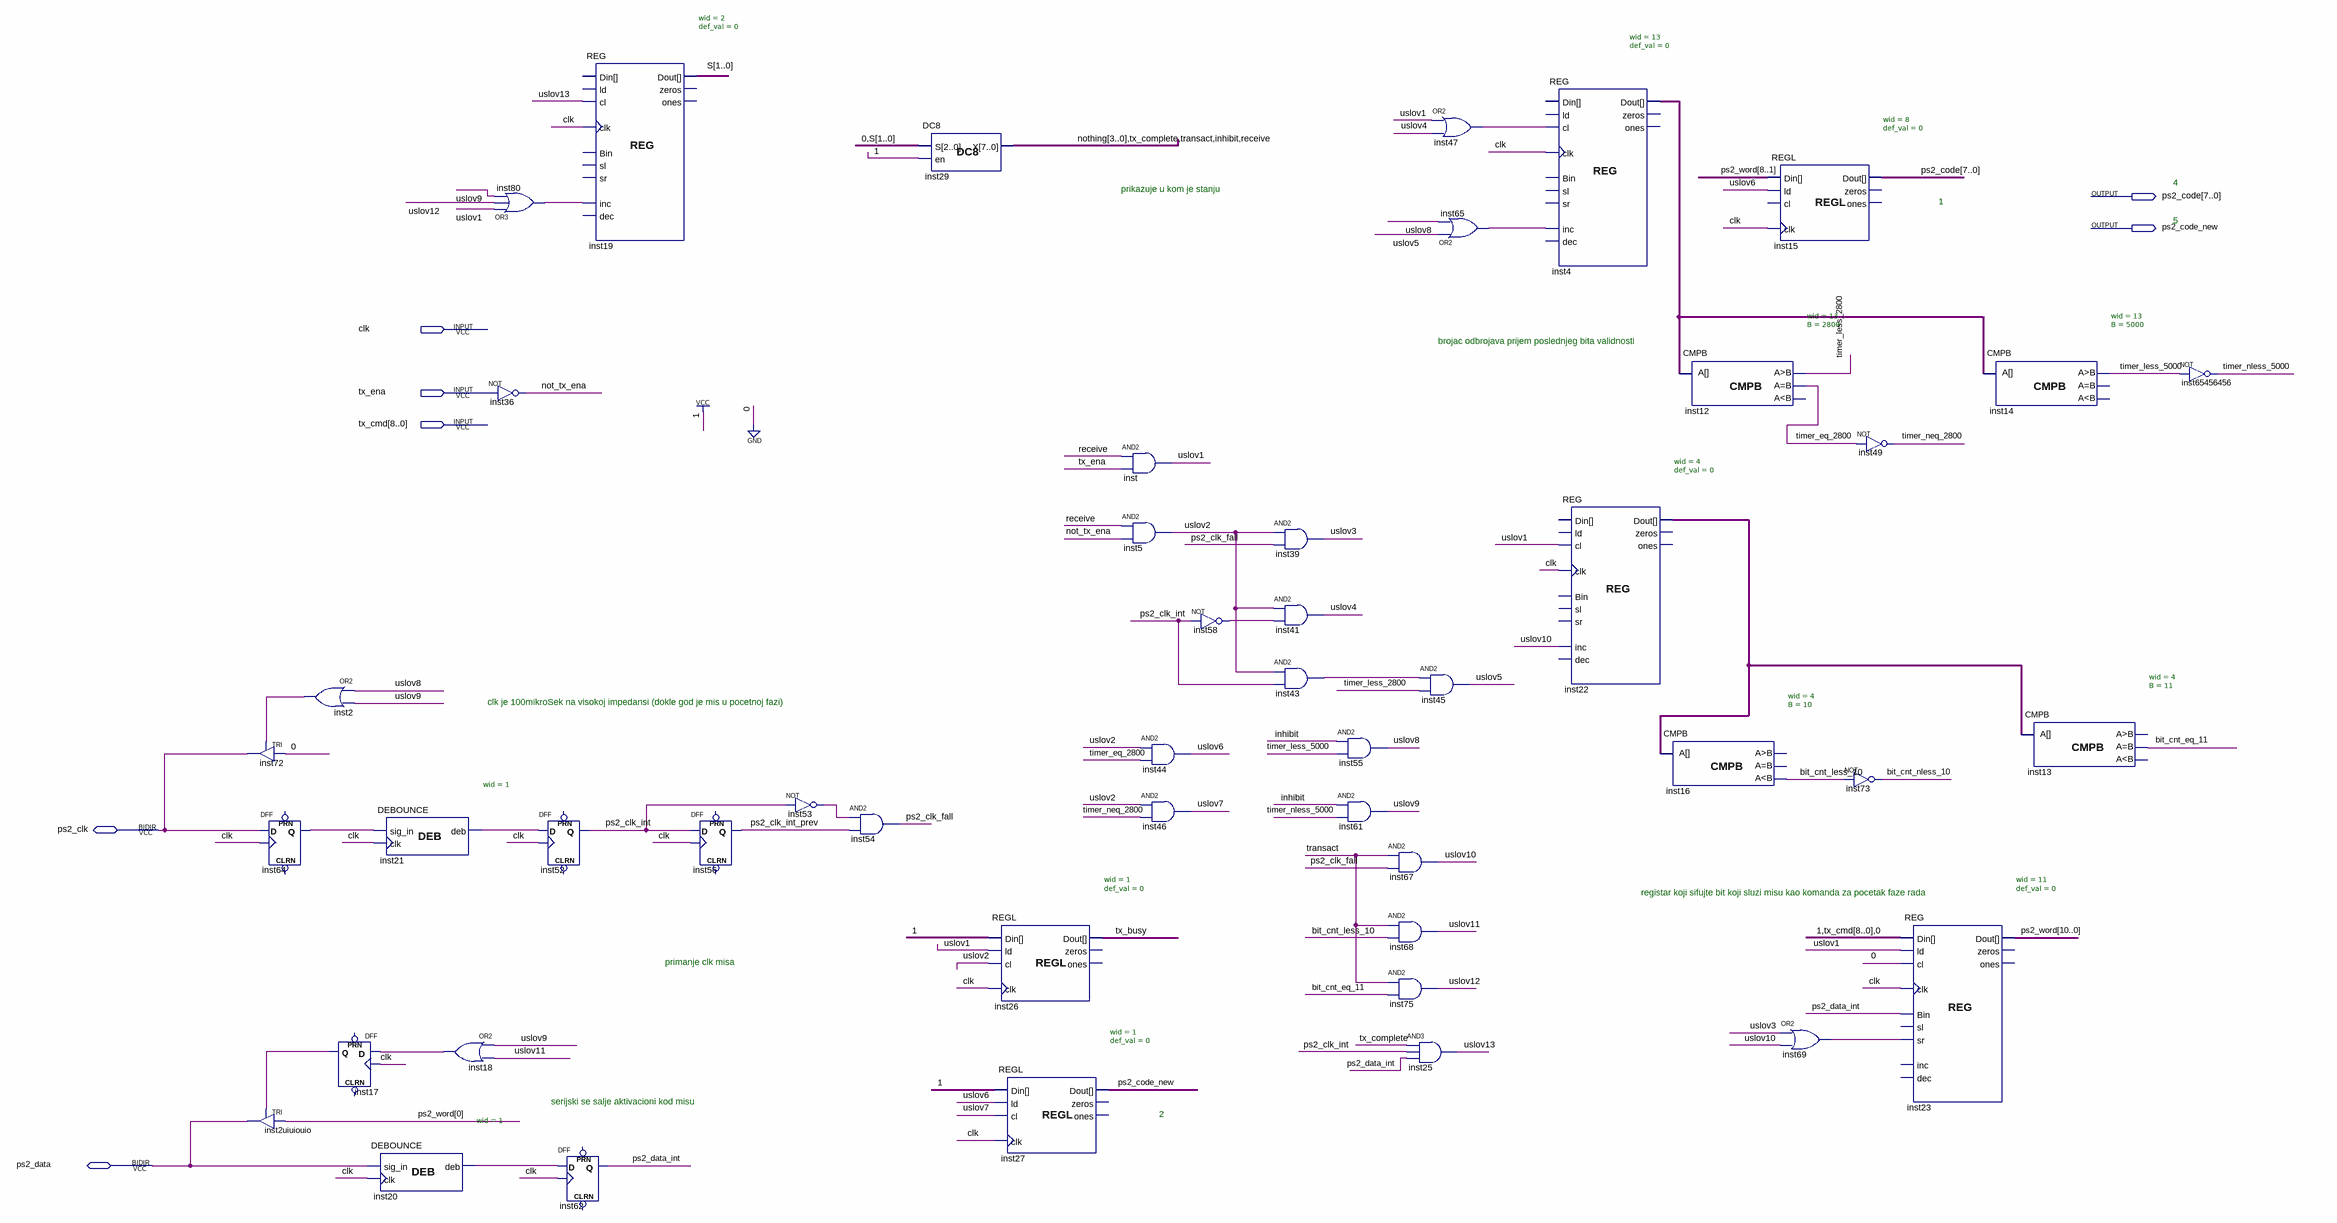
[diagram p0: schematic sheet]
// Quartus schematic transiver.bdf as structural Verilog: 48 symbols, 7 pins
module transiver (
  input  clk,
  input  tx_ena,
  input  [8:0] tx_cmd,
  inout  ps2_clk,
  inout  ps2_data,
  output [7:0] ps2_code,
  output ps2_code_new
);

  wire bit_cnt_eq_11, bit_cnt_less_10, bit_cnt_nless_10, inhibit, inst2_out, inst17_q, inst18_out,
       inst20_deb, inst21_deb, inst43_out, inst47_out, inst53_out, inst58_out, inst64_q, inst65_out,
       inst69_out, inst80_out, not_tx_ena, ps2_clk_fall, ps2_clk_int, ps2_clk_int_prev, ps2_data_int,
       receive, timer_eq_2800, timer_less_2800, timer_less_5000, timer_neq_2800, timer_nless_5000, transact,
       tx_busy, tx_complete, uslov1, uslov2, uslov3, uslov4, uslov5, uslov6, uslov7, uslov8, uslov9, uslov10,
       uslov11, uslov12, uslov13;
  wire [1:0] S;
  wire [3:0] inst22_dout, nothing;
  wire [10:0] ps2_word;
  wire [12:0] inst4_dout;

  TRI inst72 (.IN(1'b0), .OE(inst2_out), .OUT(ps2_clk));
  DFF inst64 (.CLK(clk), .D(ps2_clk), .Q(inst64_q));  // open: CLRN, PRN
  TRI inst2uiuiouio (.IN(ps2_word[0]), .OE(inst17_q), .OUT(ps2_data));
  or inst2 (inst2_out, uslov8, uslov9);
  DFF inst17 (.CLK(clk), .D(inst18_out), .Q(inst17_q));  // open: CLRN, PRN
  DEBOUNCE #(.wid(1)) inst21 (.sig_in(inst64_q), .clk(clk), .deb(inst21_deb));
  DEBOUNCE #(.wid(1)) inst20 (.sig_in(ps2_data), .clk(clk), .deb(inst20_deb));
  not inst36 (not_tx_ena, tx_ena);
  or inst18 (inst18_out, uslov9, uslov11);
  or inst80 (inst80_out, uslov1, uslov12, uslov9);
  DFF inst52 (.CLK(clk), .D(inst21_deb), .Q(ps2_clk_int));  // open: CLRN, PRN
  REG #(.wid(2), .def_val(0)) inst19 (
    .cl(uslov13), .clk(clk), .inc(inst80_out), .Dout(S));  // open: ld, Bin, sl, sr, dec, Din, zeros, ones
  DFF inst62 (.CLK(clk), .D(inst20_deb), .Q(ps2_data_int));  // open: CLRN, PRN
  DFF inst56 (.CLK(clk), .D(ps2_clk_int), .Q(ps2_clk_int_prev));  // open: CLRN, PRN
  not inst53 (inst53_out, ps2_clk_int);
  and inst54 (ps2_clk_fall, inst53_out, ps2_clk_int_prev);
  DC8 inst29 (.S({1'b0, S}), .en(1'b1), .X({nothing, tx_complete, transact, inhibit, receive}));
  REGL #(.wid(1), .def_val(0)) inst26 (
    .Din(1'b1), .ld(uslov1), .cl(uslov2), .clk(clk), .Dout(tx_busy));  // open: zeros, ones
  REGL #(.wid(1), .def_val(0)) inst27 (
    .Din(1'b1), .ld(uslov6), .cl(uslov7), .clk(clk), .Dout(ps2_code_new));  // open: zeros, ones
  and inst (uslov1, receive, tx_ena);
  and inst5 (uslov2, receive, not_tx_ena);
  and inst44 (uslov6, uslov2, timer_eq_2800);
  and inst46 (uslov7, uslov2, timer_neq_2800);
  not inst58 (inst58_out, ps2_clk_int);
  and inst39 (uslov3, uslov2, ps2_clk_fall);
  and inst41 (uslov4, uslov2, inst58_out);
  and inst43 (inst43_out, uslov2, ps2_clk_int);
  and inst55 (uslov8, inhibit, timer_less_5000);
  and inst61 (uslov9, inhibit, timer_nless_5000);
  and inst67 (uslov10, transact, ps2_clk_fall);
  and inst68 (uslov11, transact, bit_cnt_less_10);
  and inst75 (uslov12, transact, bit_cnt_eq_11);
  or inst47 (inst47_out, uslov1, uslov4);
  or inst65 (inst65_out, uslov5, uslov8);
  and inst45 (uslov5, inst43_out, timer_less_2800);
  and inst25 (uslov13, tx_complete, ps2_clk_int, ps2_data_int);
  REG #(.wid(13), .def_val(0)) inst4 (
    .cl(inst47_out), .clk(clk), .inc(inst65_out), .Dout(inst4_dout));  // open: ld, Bin, sl, sr, dec, Din, zeros, ones
  REG #(.wid(4), .def_val(0)) inst22 (
    .cl(uslov1), .clk(clk), .inc(uslov10), .Dout(inst22_dout));  // open: ld, Bin, sl, sr, dec, Din, zeros, ones
  CMPB #(.wid(13), .B(2800)) inst12 (.A(inst4_dout), .gr(timer_less_2800), .eq(timer_eq_2800));  // open: ls
  CMPB #(.wid(4), .B(10)) inst16 (.A(inst22_dout), .ls(bit_cnt_less_10));  // open: gr, eq
  REGL #(.wid(8), .def_val(0)) inst15 (
    .Din(ps2_word[8:1]), .ld(uslov6), .clk(clk), .Dout(ps2_code));  // open: cl, zeros, ones
  or inst69 (inst69_out, uslov3, uslov10);
  not inst49 (timer_neq_2800, timer_eq_2800);
  not inst73 (bit_cnt_nless_10, bit_cnt_less_10);
  REG #(.wid(11), .def_val(0)) inst23 (
    .ld(uslov1), .cl(1'b0), .clk(clk), .Bin(ps2_data_int), .sr(inst69_out), .Din({1'b1, tx_cmd, 1'b0}),
    .Dout(ps2_word));  // open: sl, inc, dec, zeros, ones
  CMPB #(.wid(13), .B(5000)) inst14 (.A(inst4_dout), .gr(timer_less_5000));  // open: eq, ls
  CMPB #(.wid(4), .B(11)) inst13 (.A(inst22_dout), .eq(bit_cnt_eq_11));  // open: gr, ls
  not inst65456456 (timer_nless_5000, timer_less_5000);

  // Notes on the sheet:
  //   4
  //   prikazuje u kom je stanju    
  //   1
  //   5
  //   brojac odbrojava prijem poslednjeg bita validnosti  
  //   clk je 100mikroSek na visokoj impedansi (dokle god je mis u pocetnoj fazi)          
  //   registar koji sifujte bit koji sluzi misu kao komanda za pocetak faze rada        
  //   primanje clk misa          
  //   serijski se salje aktivacioni kod misu        
  //   2
endmodule
